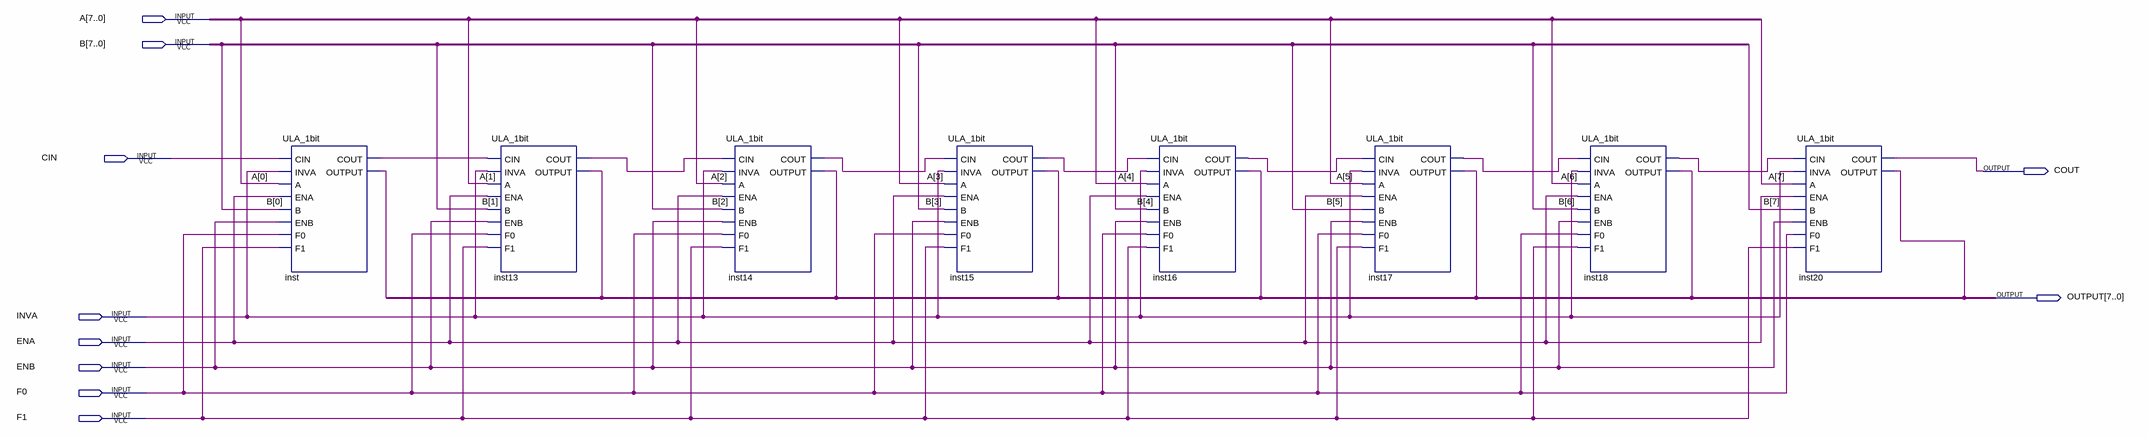
[diagram p0: schematic sheet]
// Quartus schematic ULA_8bit.bdf as structural Verilog: 8 symbols, 10 pins
module ULA_8bit (
  input  [7:0] A,
  input  [7:0] B,
  input  CIN,
  input  INVA,
  input  ENA,
  input  ENB,
  input  F0,
  input  F1,
  output COUT,
  output [7:0] OUTPUT
);

  wire inst13_cout, inst13_output, inst14_cout, inst14_output, inst15_cout, inst15_output, inst16_cout,
       inst16_output, inst17_cout, inst17_output, inst18_cout, inst18_output, inst20_output, inst_cout,
       inst_output;

  ULA_1bit inst (
    .CIN(CIN), .INVA(INVA), .A(A[0]), .ENA(ENA), .B(B[0]), .ENB(ENB), .F0(F0), .F1(F1), .COUT(inst_cout),
    .OUTPUT(inst_output));
  ULA_1bit inst13 (
    .CIN(inst_cout), .INVA(INVA), .A(A[1]), .ENA(ENA), .B(B[1]), .ENB(ENB), .F0(F0), .F1(F1),
    .COUT(inst13_cout), .OUTPUT(inst13_output));
  ULA_1bit inst14 (
    .CIN(inst13_cout), .INVA(INVA), .A(A[2]), .ENA(ENA), .B(B[2]), .ENB(ENB), .F0(F0), .F1(F1),
    .COUT(inst14_cout), .OUTPUT(inst14_output));
  ULA_1bit inst15 (
    .CIN(inst14_cout), .INVA(INVA), .A(A[3]), .ENA(ENA), .B(B[3]), .ENB(ENB), .F0(F0), .F1(F1),
    .COUT(inst15_cout), .OUTPUT(inst15_output));
  ULA_1bit inst16 (
    .CIN(inst15_cout), .INVA(INVA), .A(A[4]), .ENA(ENA), .B(B[4]), .ENB(ENB), .F0(F0), .F1(F1),
    .COUT(inst16_cout), .OUTPUT(inst16_output));
  ULA_1bit inst17 (
    .CIN(inst16_cout), .INVA(INVA), .A(A[5]), .ENA(ENA), .B(B[5]), .ENB(ENB), .F0(F0), .F1(F1),
    .COUT(inst17_cout), .OUTPUT(inst17_output));
  ULA_1bit inst18 (
    .CIN(inst17_cout), .INVA(INVA), .A(A[6]), .ENA(ENA), .B(B[6]), .ENB(ENB), .F0(F0), .F1(F1),
    .COUT(inst18_cout), .OUTPUT(inst18_output));
  ULA_1bit inst20 (
    .CIN(inst18_cout), .INVA(INVA), .A(A[7]), .ENA(ENA), .B(B[7]), .ENB(ENB), .F0(F0), .F1(F1), .COUT(COUT),
    .OUTPUT(inst20_output));
endmodule
